# Altium schematic sheet left sub.schdoc
size 263 x 156 mm
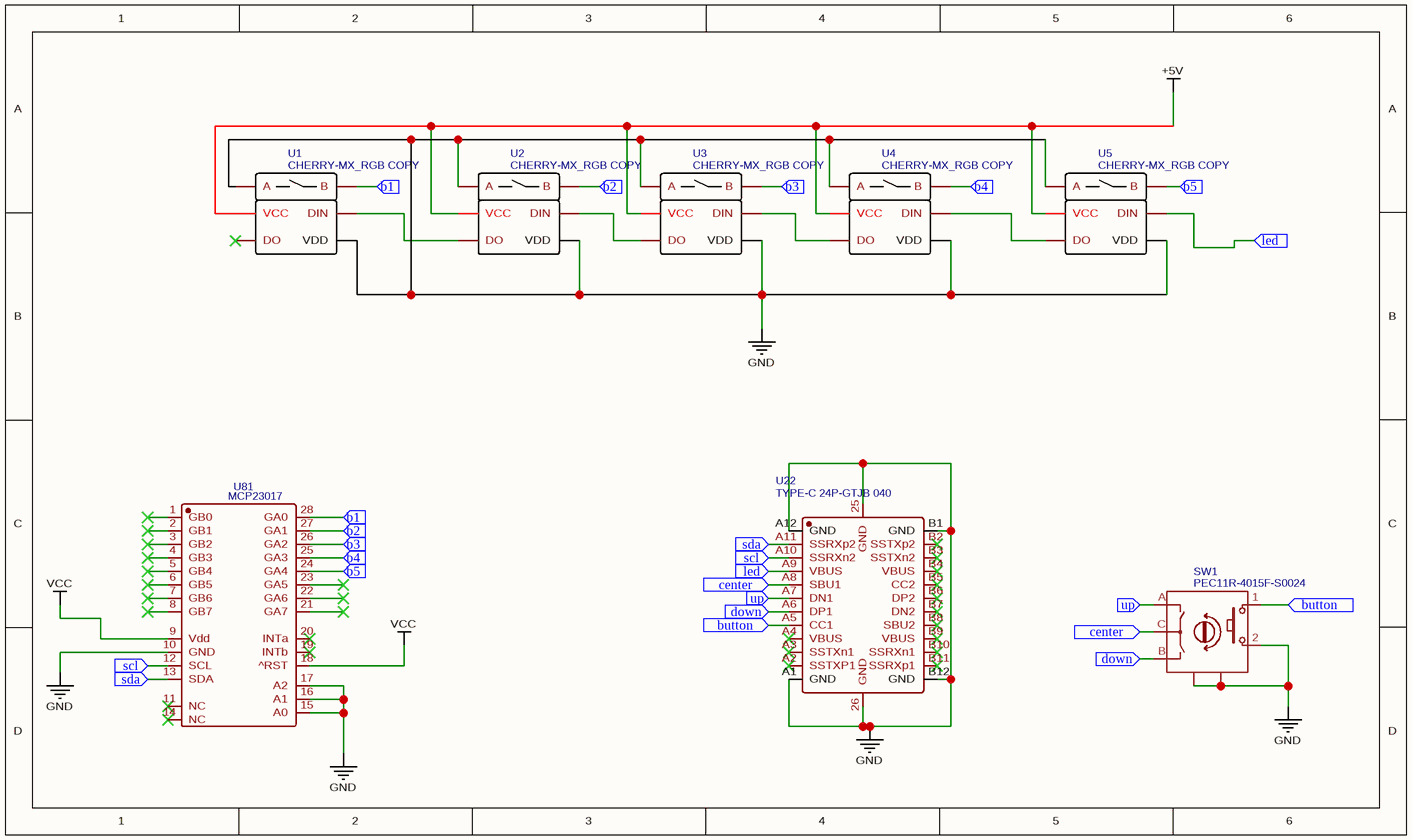
[diagram p0: left sub.schdoc]

## Parts
SW1  PEC11R-4015F-S0024  [SW-TH_PEC11R-4XXXF-SXXXX]
U1  CHERRY-MX_RGB COPY  [CHERRY-MX-RGB]
U2  CHERRY-MX_RGB COPY  [CHERRY-MX-RGB]
U3  CHERRY-MX_RGB COPY  [CHERRY-MX-RGB]
U4  CHERRY-MX_RGB COPY  [CHERRY-MX-RGB]
U5  CHERRY-MX_RGB COPY  [CHERRY-MX-RGB]
U22  TYPE-C 24P-GTJB 040  [USB-C-SMD_TYPE-C-24P-GTJB-040]
U81  MCP23017  [DIP-28_300MIL]

## Ports
b1 (in), b2 (in), b3 (in), b4 (in), b5 (in), button (in), center (in), down (in), led (in), scl (in), sda (in), up (in)

## Nets
+5V: U1.3(VCC) U2.3(VCC) U3.3(VCC) U4.3(VCC) U5.3(VCC)
GND: SW1.2 SW1.MT1 SW1.MT2 U1.1(A) U1.5(VDD) U2.1(A) U2.5(VDD) U3.1(A) U3.5(VDD) U4.1(A) U4.5(VDD) U5.1(A) U5.5(VDD) U22.25(GND) U22.26(GND) U22.A1(GND) U22.A12(GND) U22.B1(GND) U22.B12(GND) U81.10(GND) U81.15(A0) U81.16(A1) U81.17(A2)
VCC: U81.9(Vdd) U81.18(^RST)
b1: U1.2(B) U81.28(GA0) ; port b1
b2: U2.2(B) U81.27(GA1) ; port b2
b3: U3.2(B) U81.26(GA2) ; port b3
b4: U4.2(B) U81.25(GA3) ; port b4
b5: U5.2(B) U81.24(GA4) ; port b5
button: SW1.1 U22.A5(CC1) ; port button
center: SW1.C U22.A8(SBU1) ; port center
down: SW1.B U22.A6(DP1) ; port down
led: U5.6(DIN) U22.A9(VBUS) ; port led
scl: U22.A10(SSRXn2) U81.12(SCL) ; port scl
sda: U22.A11(SSRXp2) U81.13(SDA) ; port sda
up: SW1.A U22.A7(DN1) ; port up
NetU1_6: U1.6(DIN) U2.4(DO)
NetU2_6: U2.6(DIN) U3.4(DO)
NetU3_6: U3.6(DIN) U4.4(DO)
NetU4_6: U4.6(DIN) U5.4(DO)

Not connected (* = marked no-connect by the designer): U1 4(DO)*; U22 A2(SSTXP1)* A3(SSTXn1)* A4(VBUS)* B2(SSTXp2)* B3(SSTXn2)* B4(VBUS)* B5(CC2)* B6(DP2)* B7(DN2)* B8(SBU2)* B9(VBUS)* B10(SSRXn1)* B11(SSRXp1)*; U81 1(GB0)* 2(GB1)* 3(GB2)* 4(GB3)* 5(GB4)* 6(GB5)* 7(GB6)* 8(GB7)* 11(NC)* 14(NC)* 19(INTb)* 20(INTa)* 21(GA7)* 22(GA6)* 23(GA5)*

## Library data of the parts
SW1 = PEC11R-4015F-S0024: Manufacturer: BOURNS; Contributor: LCSC; Supplier: LCSC; Supplier Part: C143789; Manufacturer Part: PEC11R-4015F-S0024; JLCPCB Part Class: Extended Part; spicePre: S; spiceSymbolName: PEC11R-4015F-S0024
U1-U5 = CHERRY-MX_RGB COPY: Contributor: unrealin01; spicePre: U; spiceSymbolName: CHERRY-MX_RGB COPY
U22 = TYPE-C 24P-GTJB 040: Manufacturer: SHOU HAN(首韩); Contributor: lcsc; Supplier: LCSC; Supplier Part: C3151751; Manufacturer Part: TYPE-C 24P-GTJB 040; JLCPCB Part Class: Extended Part; spicePre: U; spiceSymbolName: TYPE-C 24P-GTJB 040
U81 = MCP23017: nameAlias: Model; catid: 20; Contributor: tsvstar; spicePre: X; spiceSymbolName: MCP23017